# Altium project STM32F207.PrjPCB
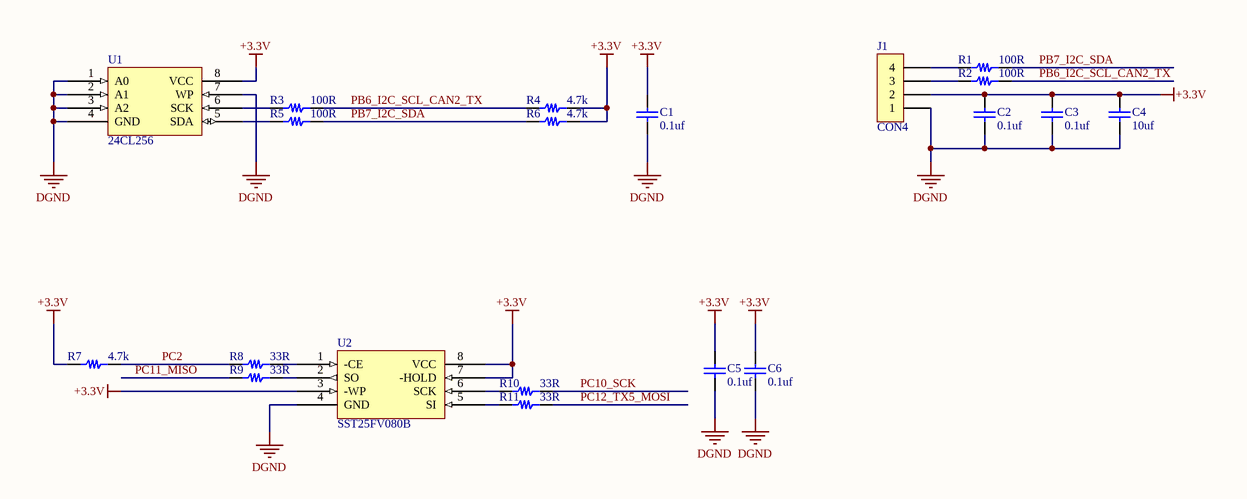
[diagram p0: at24c02_SST25FV080B_OLED.SchDoc]
11 sheets, 225 parts. Net scope: global (net labels, ports and power ports of the same name join across sheets).
Board file: STM32F207VE_Board.PcbDoc
Sheets:
  at24c02_SST25FV080B_OLED.SchDoc
  power.SchDoc
  STM32F107_207.SchDoc
  led.SchDoc
  Ethernet.SchDoc
  CAN.SchDoc
  RS232_485.SchDoc
  USB.SchDoc
  OV2640.SchDoc
  SD_NRF_RC522_W5500.SchDoc
  IO.SchDoc

## Sheet at24c02_SST25FV080B_OLED.SchDoc: STM32F208外部存储模块及OLED屏接口
size A4; Date: 2016-7-18; Author: Veiko; CompanyName: 艺嵌科技; DrawnBy: Veiko; DocumentNumber: 001; Revision: V1.0; CurrentTime: 14:27; DocumentName: STM32F208外部存储模块及OLED屏接口

### Parts
C1  0.1uf  [0805C]
C2  0.1uf  [0805C]
C3  0.1uf  [0805C]
C4  10uf  [0805C]
C5  0.1uf  [0805C]
C6  0.1uf  [0805C]
J1  CON4  [SIP4-2.54MM]
R1  100R  [0805_small]
R2  100R  [0805_small]
R3  100R  [0805_small]
R4  4.7k  [0805_small]
R5  100R  [0805_small]
R6  4.7k  [0805_small]
R7  4.7k  [0805_small]
R8  33R  [0805_small]
R9  33R  [0805_small]
R10  33R  [0805_small]
R11  33R  [0805_small]
U1  24CL256  [SO-8]
U2  SST25FV080B  [SO-8]

### Nets
+3.3V: C1.2 C2.2 C3.2 C4.2 C5.2 C6.2 J1.2 R4.1 R6.1 R7.2 U1.8(VCC) U2.3(-WP) U2.7(-HOLD) U2.8(VCC)
DGND: C1.1 C2.1 C3.1 C4.1 C5.1 C6.1 J1.1 U1.1(A0) U1.2(A1) U1.3(A2) U1.4(GND) U1.7(WP) U2.4(GND)
PB6_I2C_SCL_CAN2_TX: R2.1 R3.1 R4.2
PB7_I2C_SDA: R1.1 R5.1 R6.2
PC2: R7.1 R8.2
PC10_SCK: R10.1  [project net DATA2]
PC11_MISO: R9.2  [project net CD]
PC12_TX5_MOSI: R11.1  [project net CLK]
NetJ1_3: J1.3 R2.2
NetJ1_4: J1.4 R1.2
NetR3_2: R3.2 U1.6(SCK)
NetR5_2: R5.2 U1.5(SDA)
NetR8_1: R8.1 U2.1(-CE)
NetR9_1: R9.1 U2.2(SO)
NetR10_2: R10.2 U2.6(SCK)
NetR11_2: R11.2 U2.5(SI)

### Library data of the parts
C1-C6 = Cap: 贴片电容; Value: 100pF; Published: 8-Jun-2000; LatestRevisionDate: 17-Jul-2002; LatestRevisionNote: Re-released for DXP Platform.; PackageReference: RAD-0.3; Publisher: Altium Limited
J1 = CON4: Connector
R1-R11 = Res: 电阻; Value: 230k; Published: 24-Mar-1999; LatestRevisionDate: 29-May-2009; LatestRevisionNote: IPC-7351 Footprint Added.; PackageVersion: Mar-2003; PackageReference: 6-0805; Publisher: Altium Limited; PackageDescription: Chip Resistor 0805 Case Size; Code_IPC: RESC2012

## Sheet power.SchDoc
size A4
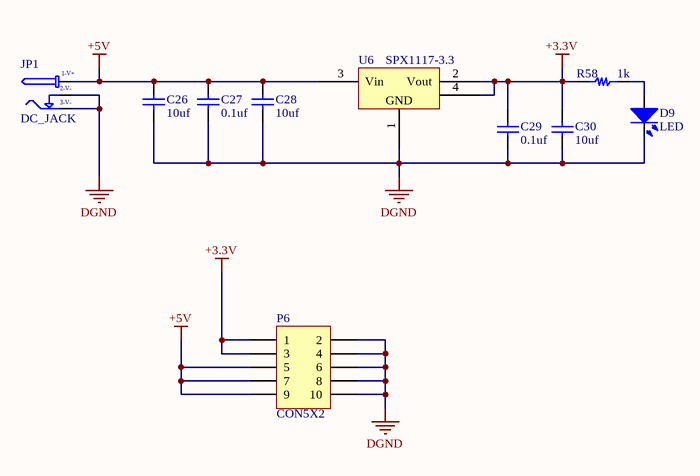
[diagram p1: power.SchDoc]

### Parts
C26  10uf  [0805C]
C27  0.1uf  [0805C]
C28  10uf  [0805C]
C29  0.1uf  [0805C]
C30  10uf  [0805C]
D9  LED  [0805-LED-RED]
JP1  DC_JACK  [DC3]
P6  CON5X2  [HDR2X5-2.54MM]
R58  1k  [0805_small]
U6  SPX1117-3.3  [SOT-223(DCY4)]

### Nets
+3.3V: C29.2 C30.2 P6.1 P6.3 R58.2 U6.2(Vout) U6.4
+5V: C26.2 C27.2 C28.2 JP1.1 P6.5 P6.7 P6.9 U6.3(Vin)
DGND: C26.1 C27.1 C28.1 C29.1 C30.1 D9.2(K) JP1.2 JP1.3 P6.2 P6.4 P6.6 P6.8 P6.10 U6.1
NetD9_1: D9.1(A) R58.1

### Notes on the sheet
- (in symbol DC_JACK) 1-V+; 2-V-; 3-V-
- (in symbol SPX1117) GND

### Library data of the parts
C26-C30 = Cap: 贴片电容; Value: 100pF; Published: 8-Jun-2000; LatestRevisionDate: 17-Jul-2002; LatestRevisionNote: Re-released for DXP Platform.; PackageReference: RAD-0.3; Publisher: Altium Limited
D9 = LED: Typical INFRARED GaAs LED; Published: 8-Jun-2000; LatestRevisionDate: 08-Jul-2005; LatestRevisionNote: Mech Layer 1 removed.; PackageReference: LED-0; Publisher: Altium Limited; PackageDescription: LED; 2 Leads
JP1 = DC_JACK: DC电源接口
P6 = CON5X2: Header, 5-Pin, Dual row; LatestRevisionDate: 17-Jul-2002; LatestRevisionNote: Re-released for DXP Platform.; Publisher: Altium Limited
R58 = Res: 电阻; Value: 230k; Published: 24-Mar-1999; LatestRevisionDate: 29-May-2009; LatestRevisionNote: IPC-7351 Footprint Added.; PackageVersion: Mar-2003; PackageReference: 6-0805; Publisher: Altium Limited; PackageDescription: Chip Resistor 0805 Case Size; Code_IPC: RESC2012
U6 = SPX1117

## Sheet STM32F107_207.SchDoc
size A4
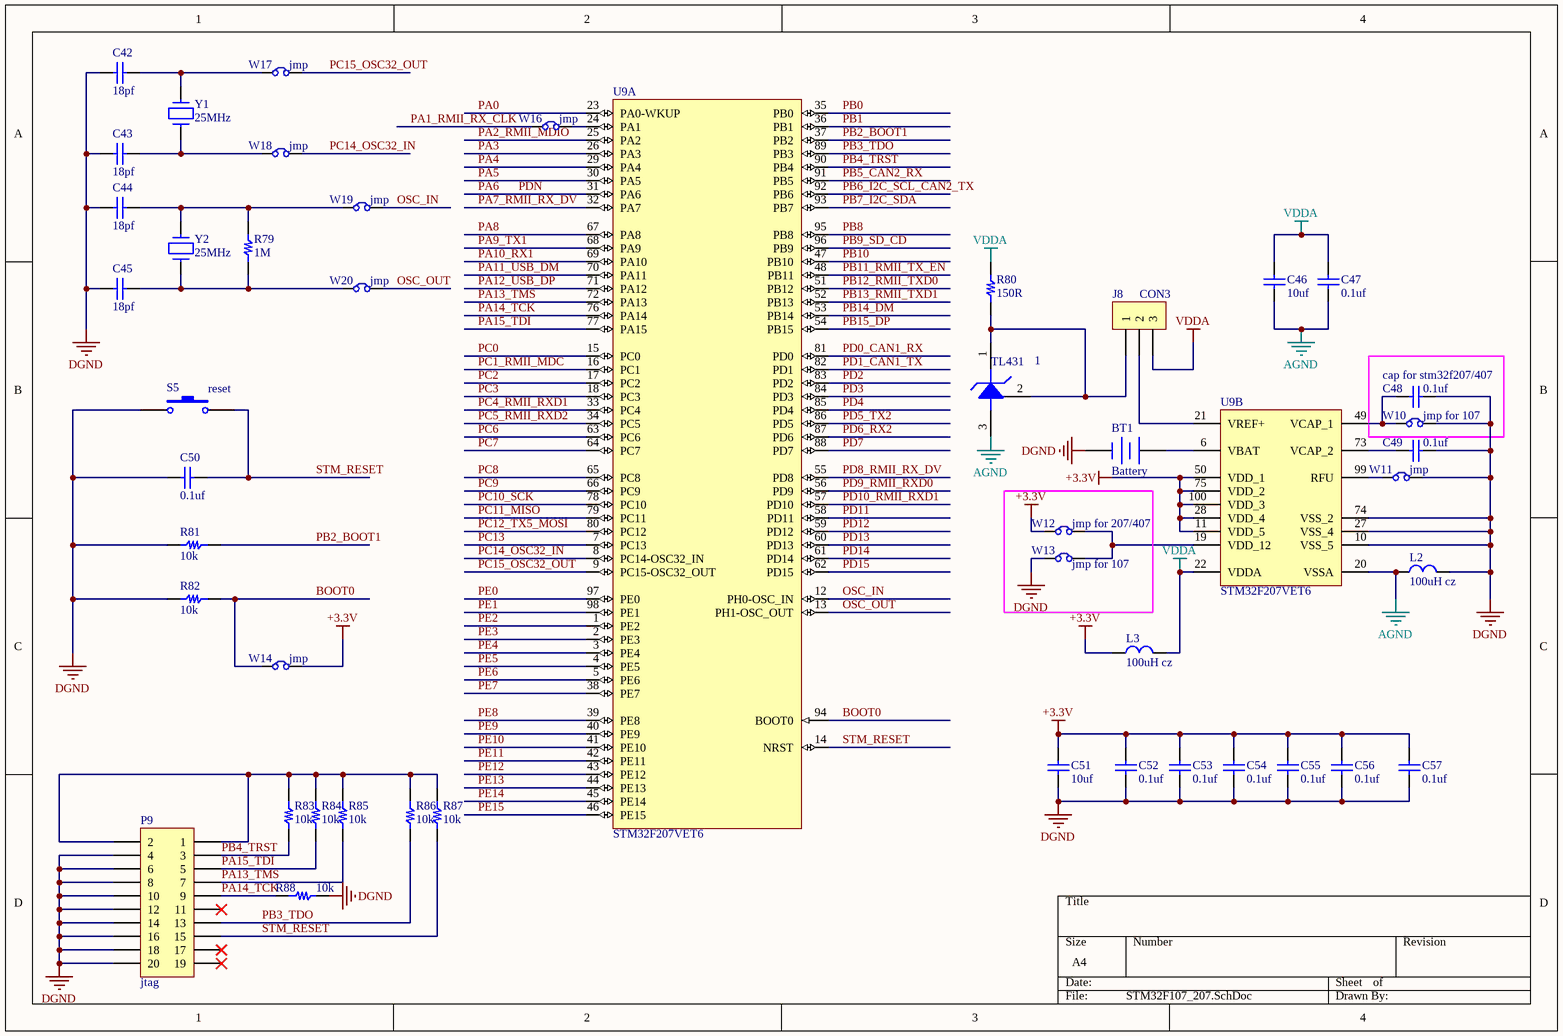
[diagram p2: STM32F107_207.SchDoc]

### Parts
1  TL431  [SOT23]
BT1  Battery  [CR1220]
C42  18pf  [0805C]
C43  18pf  [0805C]
C44  18pf  [0805C]
C45  18pf  [0805C]
C46  10uf  [0805C]
C47  0.1uf  [0805C]
C48  0.1uf  [0805C]
C49  0.1uf  [0805C]
C50  0.1uf  [0805C]
C51  10uf  [0805C]
C52  0.1uf  [0805C]
C53  0.1uf  [0805C]
C54  0.1uf  [0805C]
C55  0.1uf  [0805C]
C56  0.1uf  [0805C]
C57  0.1uf  [0805C]
J8  CON3  [sip3-2.54mm]
L2  100uH cz  [0805_SmallR]
L3  100uH cz  [0805_SmallR]
P9  jtag  [IDE20-2.54MM]
R79  1M  [0805_small]
R80  150R  [0805_small]
R81  10k  [0805_small]
R82  10k  [0805_small]
R83  10k  [0805_small]
R84  10k  [0805_small]
R85  10k  [0805_small]
R86  10k  [0805_small]
R87  10k  [0805_small]
R88  10k  [0805_small]
S5  reset  [k_TS_021]
U9  STM32F207VET6  [LQFP100_N]  (parts A,B of 2)
W10  jmp for 107  [0603_jump_Pad]
W11  jmp  [0603_jump_Pad]
W12  jmp for 207/407  [0603_jump_Pad]
W13  jmp for 107  [0603_jump_Pad]
W14  jmp  [0603_jump_Pad]
W16  jmp  [0603_jump_Pad]
W17  jmp  [0603_jump_Pad]
W18  jmp  [0603_jump_Pad]
W19  jmp  [0603_jump_Pad]
W20  jmp  [0603_jump_Pad]
Y1  25MHz  [CRY 32768-1]
Y2  25MHz  [CRYSTAL]

### Blocks framed on the sheet
cap for stm32f207/407: C48 W10

### Nets
+3.3V: C51.1 C52.1 C53.1 C54.1 C55.1 C56.1 C57.1 L3.1 U9.11(VDD_5) U9.28(VDD_4) U9.50(VDD_1) U9.75(VDD_2) U9.100(VDD_3) W12.1(C1) W14.2(C2)
AGND: 1.3(ANODE) C46.1 C47.1 L2.1 U9.20(VSSA)
DGND: BT1.2(-) C42.2 C43.2 C44.2 C45.2 C48.1 C49.1 C50.2 C51.2 C52.2 C53.2 C54.2 C55.2 C56.2 C57.2 L2.2 P9.4 P9.6 P9.8 P9.10 P9.12 P9.14 P9.16 P9.18 P9.20 R81.2 R82.2 R88.2 S5.1 U9.10(VSS_5) U9.27(VSS_4) U9.74(VSS_2) W10.2(C2) W11.2(C2) W13.1(C1)
VDDA: C46.2 C47.2 J8.3 L3.2 R80.2 U9.22(VDDA)
BOOT0: R82.1 U9.94(BOOT0) W14.1(C1)
OSC_IN: U9.12(PH0-OSC_IN) W19.2(C2)
OSC_OUT: U9.13(PH1-OSC_OUT) W20.2(C2)
PA0: U9.23(PA0-WKUP)
PA1_RMII_RX_CLK: W16.1(C1)
PA2_RMII_MDIO: U9.25(PA2)
PA3: U9.26(PA3)
PA4: U9.29(PA4)
PA5: U9.30(PA5)
PA6: U9.31(PA6)  [also labelled PDN]
PA7_RMII_RX_DV: U9.32(PA7)
PA8: U9.67(PA8)
PA9_TX1: U9.68(PA9)
PA10_RX1: U9.69(PA10)
PA11_USB_DM: U9.70(PA11)
PA12_USB_DP: U9.71(PA12)
PA13_TMS: P9.7 R85.2 U9.72(PA13)
PA14_TCK: P9.9 R88.1 U9.76(PA14)
PA15_TDI: P9.5 R84.2 U9.77(PA15)
PB0: U9.35(PB0)
PB1: U9.36(PB1)
PB2_BOOT1: R81.1 U9.37(PB2)
PB3_TDO: P9.13 R86.2 U9.89(PB3)
PB4_TRST: P9.3 R83.2 U9.90(PB4)
PB5_CAN2_RX: U9.91(PB5)
PB6_I2C_SCL_CAN2_TX: U9.92(PB6)
PB7_I2C_SDA: U9.93(PB7)
PB8: U9.95(PB8)
PB9_SD_CD: U9.96(PB9)
PB10: U9.47(PB10)
PB11_RMII_TX_EN: U9.48(PB11)
PB12_RMII_TXD0: U9.51(PB12)
PB13_RMII_TXD1: U9.52(PB13)
PB14_DM: U9.53(PB14)
PB15_DP: U9.54(PB15)
PC0: U9.15(PC0)
PC1_RMII_MDC: U9.16(PC1)
PC2: U9.17(PC2)
PC3: U9.18(PC3)
PC4_RMII_RXD1: U9.33(PC4)
PC5_RMII_RXD2: U9.34(PC5)
PC6: U9.63(PC6)
PC7: U9.64(PC7)
PC8: U9.65(PC8)  [project net DTAT0]
PC9: U9.66(PC9)  [project net DTAT1]
PC10_SCK: U9.78(PC10)  [project net DATA2]
PC11_MISO: U9.79(PC11)  [project net CD]
PC12_TX5_MOSI: U9.80(PC12)  [project net CLK]
PC13: U9.7(PC13)
PC14_OSC32_IN: U9.8(PC14-OSC32_IN) W18.2(C2)
PC15_OSC32_OUT: U9.9(PC15-OSC32_OUT) W17.2(C2)
PD0_CAN1_RX: U9.81(PD0)
PD1_CAN1_TX: U9.82(PD1)
PD2: U9.83(PD2)  [project net CMD]
PD3: U9.84(PD3)
PD4: U9.85(PD4)
PD5_TX2: U9.86(PD5)
PD6_RX2: U9.87(PD6)
PD7: U9.88(PD7)
PD8_RMII_RX_DV: U9.55(PD8)
PD9_RMII_RXD0: U9.56(PD9)
PD10_RMII_RXD1: U9.57(PD10)
PD11: U9.58(PD11)
PD12: U9.59(PD12)
PD13: U9.60(PD13)
PD14: U9.61(PD14)
PD15: U9.62(PD15)
PE0: U9.97(PE0)
PE1: U9.98(PE1)
PE2: U9.1(PE2)
PE3: U9.2(PE3)
PE4: U9.3(PE4)
PE5: U9.4(PE5)
PE6: U9.5(PE6)
PE7: U9.38(PE7)
PE8: U9.39(PE8)
PE9: U9.40(PE9)
PE10: U9.41(PE10)
PE11: U9.42(PE11)
PE12: U9.43(PE12)
PE13: U9.44(PE13)
PE14: U9.45(PE14)
PE15: U9.46(PE15)
STM_RESET: C50.1 P9.15 R87.2 S5.2 U9.14(NRST)
Net1_1: 1.1(CATHODE) 1.2(REF) J8.1 R80.1
NetBT1_1: BT1.1(+) U9.6(VBAT)
NetC42_1: C42.1 W17.1(C1) Y1.2
NetC43_1: C43.1 W18.1(C1) Y1.1
NetC44_1: C44.1 R79.2 W19.1(C1) Y2.2
NetC45_1: C45.1 R79.1 W20.1(C1) Y2.1
NetC48_2: C48.2 U9.49(VCAP_1) W10.1(C1)
NetC49_2: C49.2 U9.73(VCAP_2)
NetJ8_2: J8.2 U9.21(VREF+)
NetP9_1: P9.1 P9.2 R83.1 R84.1 R85.1 R86.1 R87.1
NetU9_19: U9.19(VDD_12) W12.2(C2) W13.2(C2)
NetU9_24: U9.24(PA1) W16.2(C2)
NetU9_99: U9.99(RFU) W11.1(C1)

Not connected (* = marked no-connect by the designer): P9 11* 17* 19*

### Library data of the parts
BT1 = Battery: Multicell Battery; Published: 24-Mar-1999; LatestRevisionDate: 17-Jul-2002; LatestRevisionNote: Re-released for DXP Platform.; PackageReference: BAT-2; Publisher: Altium Limited; PackageDescription: Battery; 2 Leads
C42-C57 = Cap: 贴片电容; Value: 100pF; Published: 8-Jun-2000; LatestRevisionDate: 17-Jul-2002; LatestRevisionNote: Re-released for DXP Platform.; PackageReference: RAD-0.3; Publisher: Altium Limited
J8 = CON3: Connector
L2 L3 = Inductor: 电感; Code_IEC: 1005; Value: 4.7uH; Published: 8-Jun-2000; LatestRevisionDate: 29-May-2009; LatestRevisionNote: IPC-7351 Footprint Added.; PackageReference: 0402-A; Publisher: Altium Limited; PackageDescription: Chip Inductor; Code_JEITA: 0402
P9 = CON10X2: Header, 10-Pin, Dual row; LatestRevisionDate: 17-Jul-2002; LatestRevisionNote: Re-released for DXP Platform.; Publisher: Altium Limited
R79-R88 = Res: 电阻; Value: 230k; Published: 24-Mar-1999; LatestRevisionDate: 29-May-2009; LatestRevisionNote: IPC-7351 Footprint Added.; PackageVersion: Mar-2003; PackageReference: 6-0805; Publisher: Altium Limited; PackageDescription: Chip Resistor 0805 Case Size; Code_IPC: RESC2012
S5 = SW-PB-2: Switch; Published: 24-Mar-1999; LatestRevisionDate: 17-Jul-2002; LatestRevisionNote: Re-released for DXP Platform.; PackageReference: SPST-2; Publisher: Altium Limited; PackageDescription: Switch; 2 Leads
U9 = STM32F207VET6: STM32 ARM-based 32-bit MCU Connectivity Line & Ethernet with 512 kB Flash, 128 kB Internal RAM, -40 to +85°C Temperature, 100-Pin LQFP, Tray; DatasheetVersion: rev6.0, Apr-2011; PackageVersion: rev13, Apr-2011; PackageReference: LQFP100; PackageDescription: 100-Pin Low-Profile Quad Flat Pack, 14 x 14 mm Body, 0.5 mm Pitch (LQFP100); ComponentLink1Description: Manufacturer URL; ComponentLink1URL: http://www.st.com/; ComponentLink2Description: STM32F205/207 Datasheet; ComponentLink2URL: http://www.st.com/internet/com/TECHNICAL_RESOURCES/TECHNICAL_LITERATURE/DATASHEET/CD00237391.pdf; ComponentLink3Description: STM32 Family Web Page; ComponentLink3URL: www.st.com/stm32
W10-W14 W16-W20 = Jumper: Jumper Wire; Published: 24-Mar-1999; LatestRevisionDate: 17-Jul-2002; LatestRevisionNote: Re-released for DXP Platform.; PackageReference: RAD-0.2; Publisher: Altium Limited; PackageDescription: Radial Cap, Thru-Hole; 2 Leads; 0.2 in Pin Spacing
Y1 Y2 = CRYSTAL: JZ; Value: 4MHz

## Sheet led.SchDoc
size A4
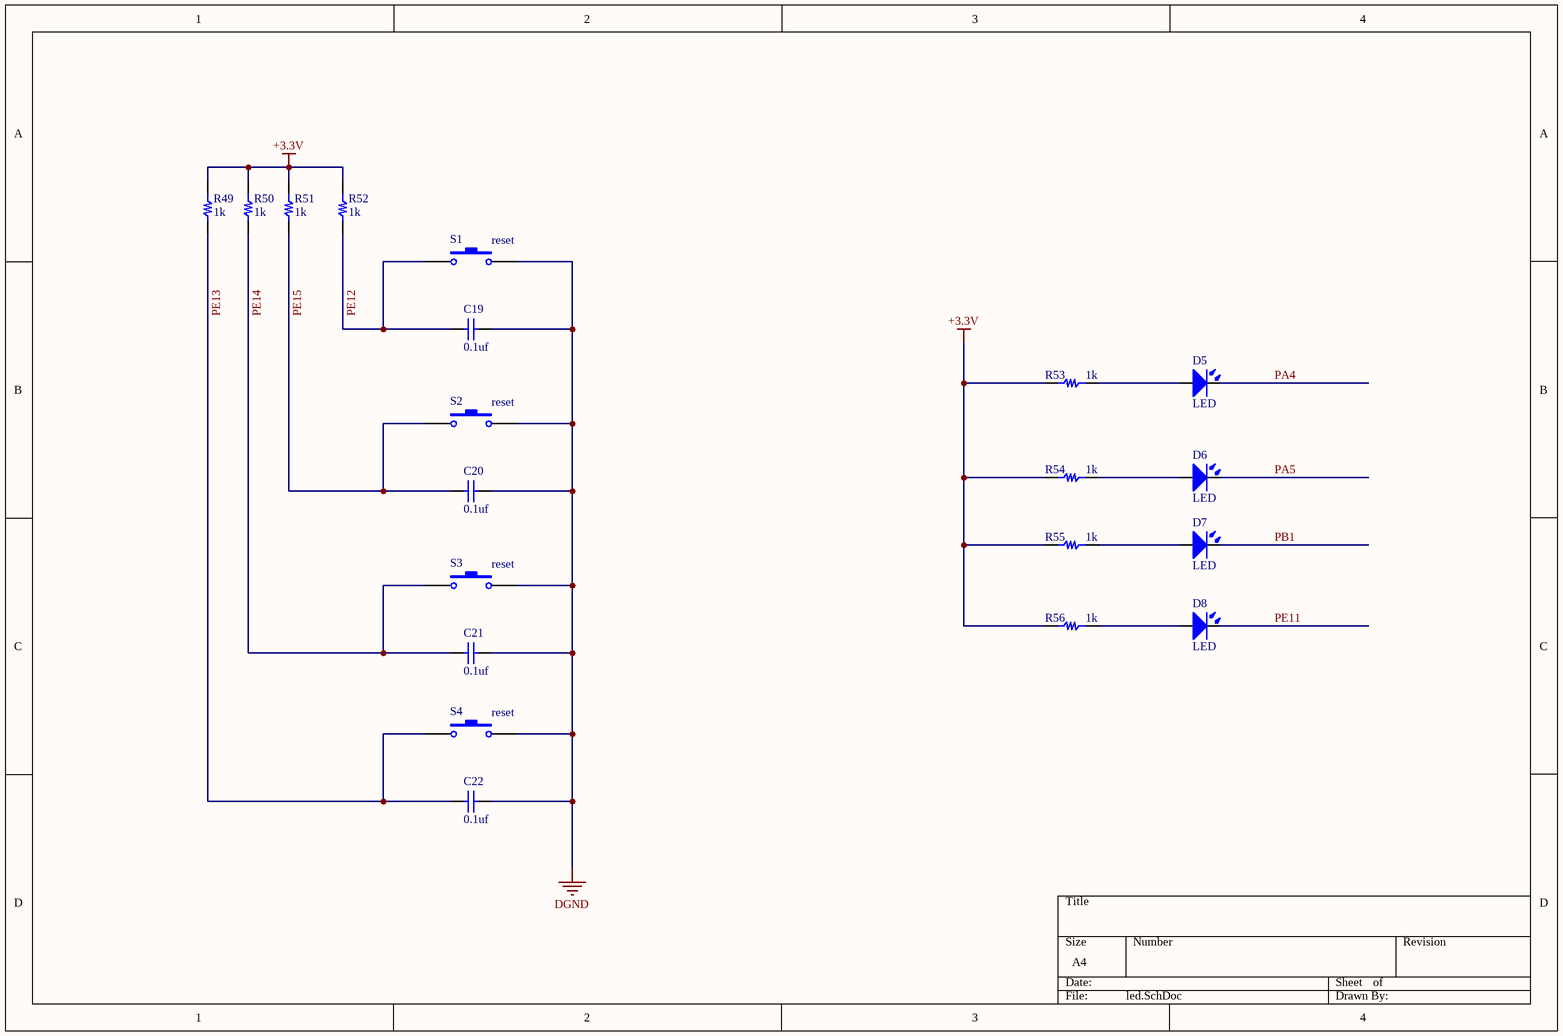
[diagram p3: led.SchDoc]

### Parts
C19  0.1uf  [0805C]
C20  0.1uf  [0805C]
C21  0.1uf  [0805C]
C22  0.1uf  [0805C]
D5  LED  [0805-LED-RED]
D6  LED  [0805-LED-RED]
D7  LED  [0805-LED-RED]
D8  LED  [0805-LED-RED]
R49  1k  [0805_small]
R50  1k  [0805_small]
R51  1k  [0805_small]
R52  1k  [0805_small]
R53  1k  [0805_small]
R54  1k  [0805_small]
R55  1k  [0805_small]
R56  1k  [0805_small]
S1  reset  [k_TS_021]
S2  reset  [k_TS_021]
S3  reset  [k_TS_021]
S4  reset  [k_TS_021]

### Nets
+3.3V: R49.1 R50.1 R51.1 R52.1 R53.2 R54.2 R55.2 R56.2
DGND: C19.1 C20.1 C21.1 C22.1 S1.2 S2.2 S3.2 S4.2
PA4: D5.2(K)
PA5: D6.2(K)
PB1: D7.2(K)
PE11: D8.2(K)
PE12: C19.2 R52.2 S1.1
PE13: C22.2 R49.2 S4.1
PE14: C21.2 R50.2 S3.1
PE15: C20.2 R51.2 S2.1
NetD5_1: D5.1(A) R53.1
NetD6_1: D6.1(A) R54.1
NetD7_1: D7.1(A) R55.1
NetD8_1: D8.1(A) R56.1

### Library data of the parts
C19-C22 = Cap: 贴片电容; Value: 100pF; Published: 8-Jun-2000; LatestRevisionDate: 17-Jul-2002; LatestRevisionNote: Re-released for DXP Platform.; PackageReference: RAD-0.3; Publisher: Altium Limited
D5-D8 = LED: Typical INFRARED GaAs LED; Published: 8-Jun-2000; LatestRevisionDate: 08-Jul-2005; LatestRevisionNote: Mech Layer 1 removed.; PackageReference: LED-0; Publisher: Altium Limited; PackageDescription: LED; 2 Leads
R49-R56 = Res: 电阻; Value: 230k; Published: 24-Mar-1999; LatestRevisionDate: 29-May-2009; LatestRevisionNote: IPC-7351 Footprint Added.; PackageVersion: Mar-2003; PackageReference: 6-0805; Publisher: Altium Limited; PackageDescription: Chip Resistor 0805 Case Size; Code_IPC: RESC2012
S1-S4 = SW-PB-2: Switch; Published: 24-Mar-1999; LatestRevisionDate: 17-Jul-2002; LatestRevisionNote: Re-released for DXP Platform.; PackageReference: SPST-2; Publisher: Altium Limited; PackageDescription: Switch; 2 Leads

## Sheet Ethernet.SchDoc
size A4
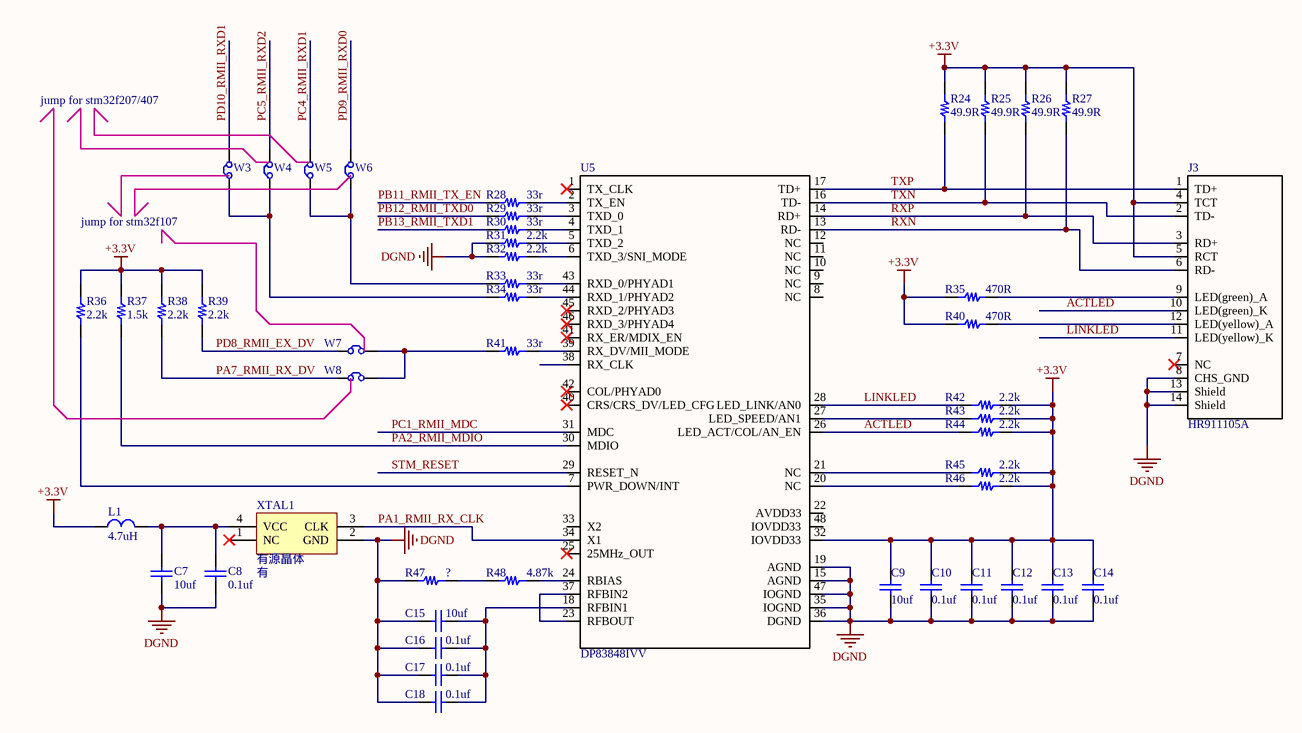
[diagram p4: Ethernet.SchDoc]

### Parts
C7  10uf  [0805C]
C8  0.1uf  [0805C]
C9  10uf  [0805C]
C10  0.1uf  [0805C]
C11  0.1uf  [0805C]
C12  0.1uf  [0805C]
C13  0.1uf  [0805C]
C14  0.1uf  [0805C]
C15  10uf  [0805C]
C16  0.1uf  [0805C]
C17  0.1uf  [0805C]
C18  0.1uf  [0805C]
J3  HR911105A  [RJ45-HR911105A]
L1  4.7uH  [0805_SmallR]
R24  49.9R  [0805_small]
R25  49.9R  [0805_small]
R26  49.9R  [0805_small]
R27  49.9R  [0805_small]
R28  33r  [0805_small]
R29  33r  [0805_small]
R30  33r  [0805_small]
R31  2.2k  [0805_small]
R32  2.2k  [0805_small]
R33  33r  [0805_small]
R34  33r  [0805_small]
R35  470R  [0805_small]
R36  2.2k  [0805_small]
R37  1.5k  [0805_small]
R38  2.2k  [0805_small]
R39  2.2k  [0805_small]
R40  470R  [0805_small]
R41  33r  [0805_small]
R42  2.2k  [0805_small]
R43  2.2k  [0805_small]
R44  2.2k  [0805_small]
R45  2.2k  [0805_small]
R46  2.2k  [0805_small]
R47  ?  [0805_small]
R48  4.87k  [0805_small]
U5  DP83848IVV  [LQFP-48]
W3  (no value)  [0603_jump_Pad]
W4  (no value)  [0603_jump_Pad]
W5  (no value)  [0603_jump_Pad]
W6  (no value)  [0603_jump_Pad]
W7  (no value)  [0603_jump_Pad]
W8  (no value)  [0603_jump_Pad]
XTAL1  有源晶体  [贴片有源晶体]

### Nets
+3.3V: C9.1 C10.1 C11.1 C12.1 C13.1 C14.1 J3.4(TCT) J3.5(RCT) L1.1 R24.1 R25.1 R26.1 R27.1 R35.1 R36.1 R37.1 R38.1 R39.1 R40.1 R42.2 R43.2 R44.2 R45.2 R46.2 U5.32(IOVDD33)
DGND: C7.2 C8.2 C9.2 C10.2 C11.2 C12.2 C13.2 C14.2 C15.2 C16.2 C17.2 C18.2 J3.8(CHS_GND) J3.13(Shield) J3.14(Shield) R31.2 R32.2 R47.2 U5.15(AGND) U5.19(AGND) U5.35(IOGND) U5.36(DGND) U5.47(IOGND) XTAL1.2(GND)
ACTLED: J3.10(LED(green)_K) R44.1 U5.26(LED_ACT/COL/AN_EN)
LINKLED: J3.11(LED(yellow)_K) R42.1 U5.28(LED_LINK/AN0)
PA1_RMII_RX_CLK: U5.34(X1) XTAL1.3(CLK)
PA2_RMII_MDIO: R37.2 U5.30(MDIO)
PA7_RMII_RX_DV: R38.2 W8.1(C1)
PB11_RMII_TX_EN: R28.2
PB12_RMII_TXD0: R29.2
PB13_RMII_TXD1: R30.2
PC1_RMII_MDC: U5.31(MDC)
PC4_RMII_RXD1: W5.2(C2)
PC5_RMII_RXD2: W4.2(C2)
PD8_RMII_EX_DV: R39.2 W7.1(C1)
PD9_RMII_RXD0: W6.2(C2)
PD10_RMII_RXD1: W3.2(C2)
RXN: J3.6(RD-) R27.2 U5.13(RD-)
RXP: J3.3(RD+) R26.2 U5.14(RD+)
STM_RESET: U5.29(RESET_N)
TXN: J3.2(TD-) R25.2 U5.16(TD-)
TXP: J3.1(TD+) R24.2 U5.17(TD+)
NetC7_1: C7.1 C8.1 L1.2 XTAL1.4(VCC)
NetC15_1: C15.1 C16.1 C17.1 C18.1 U5.18(RFBIN1)
NetJ3_9: J3.9(LED(green)_A) R35.2
NetJ3_12: J3.12(LED(yellow)_A) R40.2
NetR28_1: R28.1 U5.2(TX_EN)
NetR29_1: R29.1 U5.3(TXD_0)
NetR30_1: R30.1 U5.4(TXD_1)
NetR31_1: R31.1 U5.5(TXD_2)
NetR32_1: R32.1 U5.6(TXD_3/SNI_MODE)
NetR33_1: R33.1 U5.43(RXD_0/PHYAD1)
NetR33_2: R33.2 W5.1(C1) W6.1(C1)
NetR34_1: R34.1 U5.44(RXD_1/PHYAD2)
NetR34_2: R34.2 W3.1(C1) W4.1(C1)
NetR36_2: R36.2 U5.7(PWR_DOWN/INT)
NetR41_1: R41.1 U5.39(RX_DV/MII_MODE)
NetR41_2: R41.2 W7.2(C2) W8.2(C2)
NetR43_1: R43.1 U5.27(LED_SPEED/AN1)
NetR45_1: R45.1 U5.21(NC)
NetR46_1: R46.1 U5.20(NC)
NetR47_1: R47.1 R48.2
NetR48_1: R48.1 U5.24(RBIAS)
NetU5_23: U5.23(RFBOUT) U5.37(RFBIN2)

Not connected (* = marked no-connect by the designer): J3 7(NC)*; U5 1(TX_CLK)* 8(NC) 9(NC) 10(NC) 11(NC) 12(NC) 22(AVDD33) 25(25MHz_OUT)* 33(X2) 38(RX_CLK) 40(CRS/CRS_DV/LED_CFG)* 41(RX_ER/MDIX_EN)* 42(COL/PHYAD0)* 45(RXD_2/PHYAD3)* 46(RXD_3/PHYAD4)* 48(IOVDD33); XTAL1 1(NC)*

### Notes on the sheet
- jump for stm32f207/407
- jump for stm32f107
- (in symbol 有源晶体) 有

### Library data of the parts
C7-C18 = Cap: 贴片电容; Value: 100pF; Published: 8-Jun-2000; LatestRevisionDate: 17-Jul-2002; LatestRevisionNote: Re-released for DXP Platform.; PackageReference: RAD-0.3; Publisher: Altium Limited
J3 = HR911105A: 带网络变压器的网络接口
L1 = Inductor: 电感; Code_IEC: 1005; Published: 8-Jun-2000; LatestRevisionDate: 29-May-2009; LatestRevisionNote: IPC-7351 Footprint Added.; PackageReference: 0402-A; Publisher: Altium Limited; PackageDescription: Chip Inductor; Code_JEITA: 0402; Value: 4.7uH
R24-R48 = Res: 电阻; Value: 230k; Published: 24-Mar-1999; LatestRevisionDate: 29-May-2009; LatestRevisionNote: IPC-7351 Footprint Added.; PackageVersion: Mar-2003; PackageReference: 6-0805; Publisher: Altium Limited; PackageDescription: Chip Resistor 0805 Case Size; Code_IPC: RESC2012
U5 = DP83848IVV: DP83848 PHY
W3-W8 = Jumper: Jumper Wire; Published: 24-Mar-1999; LatestRevisionDate: 17-Jul-2002; LatestRevisionNote: Re-released for DXP Platform.; PackageReference: RAD-0.2; Publisher: Altium Limited; PackageDescription: Radial Cap, Thru-Hole; 2 Leads; 0.2 in Pin Spacing

## Sheet CAN.SchDoc
size A4
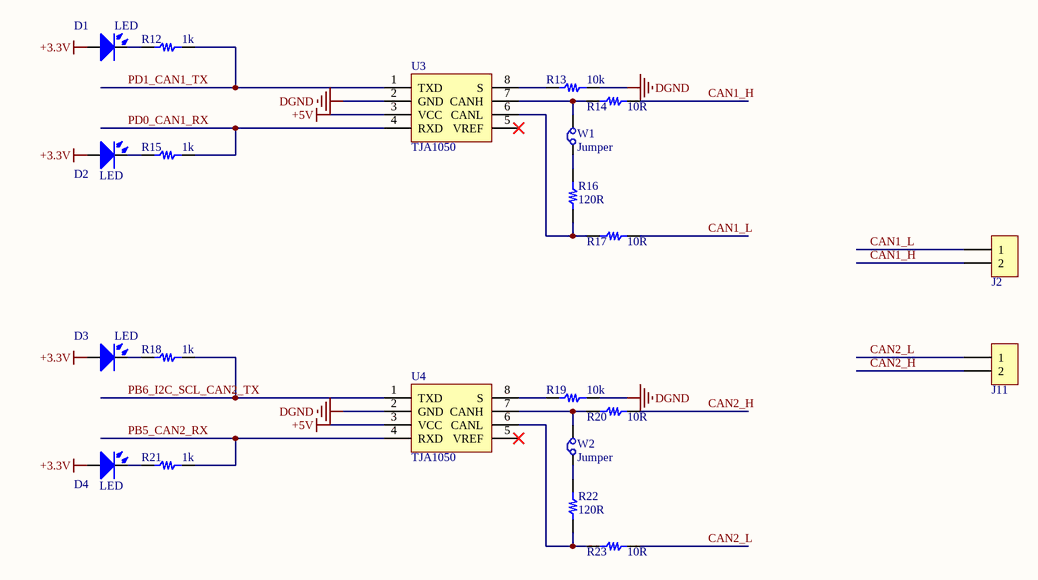
[diagram p5: CAN.SchDoc]

### Parts
D1  LED  [0805-LED-RED]
D2  LED  [0805-LED-RED]
D3  LED  [0805-LED-RED]
D4  LED  [0805-LED-RED]
J2  CON2  [XH2.54-2P]  (value not drawn)
J11  CON2  [XH2.54-2P]  (value not drawn)
R12  1k  [0805_small]
R13  10k  [0805_small]
R14  10R  [0805_small]
R15  1k  [0805_small]
R16  120R  [0805_small]
R17  10R  [0805_small]
R18  1k  [0805_small]
R19  10k  [0805_small]
R20  10R  [0805_small]
R21  1k  [0805_small]
R22  120R  [0805_small]
R23  10R  [0805_small]
U3  TJA1050  [SO-8]
U4  TJA1050  [SO-8]
W1  Jumper  [0603_jump_Pad]
W2  Jumper  [0603_jump_Pad]

### Nets
+3.3V: D1.1(A) D2.1(A) D3.1(A) D4.1(A)
+5V: U3.3(VCC) U4.3(VCC)
DGND: R13.1 R19.1 U3.2(GND) U4.2(GND)
CAN1_H: J2.2 R14.2
CAN1_L: J2.1 R17.2
CAN2_H: J11.2 R20.2
CAN2_L: J11.1 R23.2
PB5_CAN2_RX: R21.1 U4.4(RXD)
PB6_I2C_SCL_CAN2_TX: R18.1 U4.1(TXD)
PD0_CAN1_RX: R15.1 U3.4(RXD)
PD1_CAN1_TX: R12.1 U3.1(TXD)
NetD1_2: D1.2(K) R12.2
NetD2_2: D2.2(K) R15.2
NetD3_2: D3.2(K) R18.2
NetD4_2: D4.2(K) R21.2
NetR13_2: R13.2 U3.8(S)
NetR14_1: R14.1 U3.7(CANH) W1.2(C2)
NetR16_1: R16.1 W1.1(C1)
NetR16_2: R16.2 R17.1 U3.6(CANL)
NetR19_2: R19.2 U4.8(S)
NetR20_1: R20.1 U4.7(CANH) W2.2(C2)
NetR22_1: R22.1 W2.1(C1)
NetR22_2: R22.2 R23.1 U4.6(CANL)

Not connected (* = marked no-connect by the designer): U3 5(VREF)*; U4 5(VREF)*

### Library data of the parts
D1-D4 = LED: Typical INFRARED GaAs LED; Published: 8-Jun-2000; LatestRevisionDate: 08-Jul-2005; LatestRevisionNote: Mech Layer 1 removed.; PackageReference: LED-0; Publisher: Altium Limited; PackageDescription: LED; 2 Leads
J2 J11 = CON2: Connector
R12-R23 = Res: 电阻; Value: 230k; Published: 24-Mar-1999; LatestRevisionDate: 29-May-2009; LatestRevisionNote: IPC-7351 Footprint Added.; PackageVersion: Mar-2003; PackageReference: 6-0805; Publisher: Altium Limited; PackageDescription: Chip Resistor 0805 Case Size; Code_IPC: RESC2012
W1 W2 = Jumper: Jumper Wire; Published: 24-Mar-1999; LatestRevisionDate: 17-Jul-2002; LatestRevisionNote: Re-released for DXP Platform.; PackageReference: RAD-0.2; Publisher: Altium Limited; PackageDescription: Radial Cap, Thru-Hole; 2 Leads; 0.2 in Pin Spacing

## Sheet RS232_485.SchDoc
size A4
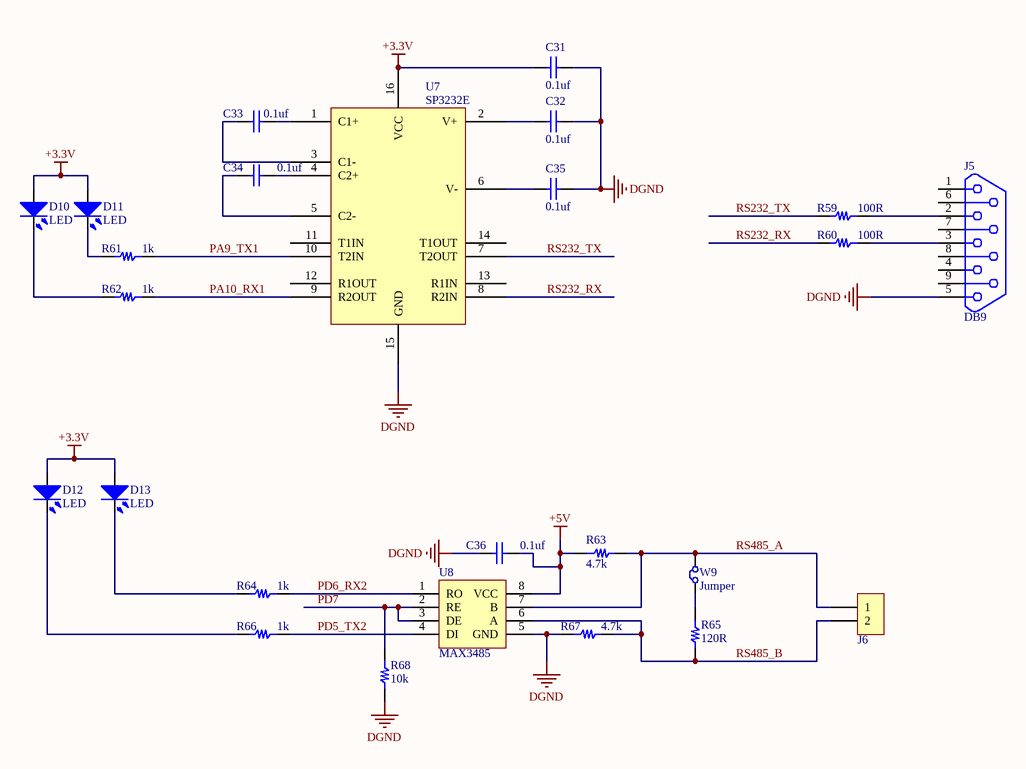
[diagram p6: RS232_485.SchDoc]

### Parts
C31  0.1uf  [0805C]
C32  0.1uf  [0805C]
C33  0.1uf  [0805C]
C34  0.1uf  [0805C]
C35  0.1uf  [0805C]
C36  0.1uf  [0805C]
D10  LED  [0805-LED-RED]
D11  LED  [0805-LED-RED]
D12  LED  [0805-LED-RED]
D13  LED  [0805-LED-RED]
J5  DB9  [DB9RA/M]
J6  CON2  [XH2.54-2P]  (value not drawn)
R59  100R  [0805_small]
R60  100R  [0805_small]
R61  1k  [0805_small]
R62  1k  [0805_small]
R63  4.7k  [0805_small]
R64  1k  [0805_small]
R65  120R  [0805_small]
R66  1k  [0805_small]
R67  4.7k  [0805_small]
R68  10k  [0805_small]
U7  SP3232E  [SO-16]
U8  MAX3485  [SO-8]
W9  Jumper  [0603_jump_Pad]

### Nets
+3.3V: C31.2 D10.1(A) D11.1(A) D12.1(A) D13.1(A) U7.16(VCC)
+5V: C36.1 R63.1 U8.8(VCC)
DGND: C31.1 C32.1 C35.1 C36.2 J5.5 R67.1 R68.2 U7.15(GND) U8.5(GND)
PA9_TX1: R61.1 U7.10(T2IN)
PA10_RX1: R62.1 U7.9(R2OUT)
PD5_TX2: R66.1 U8.4(DI)
PD6_RX2: R64.1 U8.1(RO)
PD7: R68.1 U8.2(RE) U8.3(DE)
RS232_RX: R60.2 U7.8(R2IN)
RS232_TX: R59.2 U7.7(T2OUT)
RS485_A: J6.1 R63.2 U8.7(B) W9.2(C2)
RS485_B: J6.2 R65.2 R67.2 U8.6(A)
NetC32_2: C32.2 U7.2(V+)
NetC33_1: C33.1 U7.1(C1+)
NetC33_2: C33.2 U7.3(C1-)
NetC34_1: C34.1 U7.4(C2+)
NetC34_2: C34.2 U7.5(C2-)
NetC35_2: C35.2 U7.6(V-)
NetD10_2: D10.2(K) R62.2
NetD11_2: D11.2(K) R61.2
NetD12_2: D12.2(K) R66.2
NetD13_2: D13.2(K) R64.2
NetJ5_2: J5.2 R59.1
NetJ5_3: J5.3 R60.1
NetR65_1: R65.1 W9.1(C1)

Not connected (* = marked no-connect by the designer): J5 1 4 6 7 8 9; U7 11(T1IN) 12(R1OUT) 13(R1IN) 14(T1OUT)

### Library data of the parts
C31-C36 = Cap: 贴片电容; Value: 100pF; Published: 8-Jun-2000; LatestRevisionDate: 17-Jul-2002; LatestRevisionNote: Re-released for DXP Platform.; PackageReference: RAD-0.3; Publisher: Altium Limited
D10-D13 = LED: Typical INFRARED GaAs LED; Published: 8-Jun-2000; LatestRevisionDate: 08-Jul-2005; LatestRevisionNote: Mech Layer 1 removed.; PackageReference: LED-0; Publisher: Altium Limited; PackageDescription: LED; 2 Leads
J6 = CON2: Connector
R59-R68 = Res: 电阻; Value: 230k; Published: 24-Mar-1999; LatestRevisionDate: 29-May-2009; LatestRevisionNote: IPC-7351 Footprint Added.; PackageVersion: Mar-2003; PackageReference: 6-0805; Publisher: Altium Limited; PackageDescription: Chip Resistor 0805 Case Size; Code_IPC: RESC2012
W9 = Jumper: Jumper Wire; Published: 24-Mar-1999; LatestRevisionDate: 17-Jul-2002; LatestRevisionNote: Re-released for DXP Platform.; PackageReference: RAD-0.2; Publisher: Altium Limited; PackageDescription: Radial Cap, Thru-Hole; 2 Leads; 0.2 in Pin Spacing

## Sheet USB.SchDoc
size A4
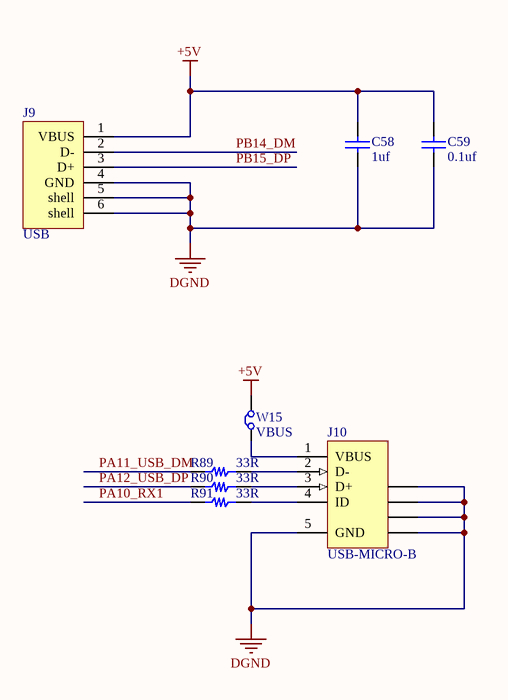
[diagram p7: USB.SchDoc]

### Parts
C58  1uf  [0805C]
C59  0.1uf  [0805C]
J9  USB  [USB-A]
J10  USB-MICRO-B  [USB-MINI-B]
R89  33R  [0805_small]
R90  33R  [0805_small]
R91  33R  [0805_small]
W15  VBUS  [sip2-2.54mm]

### Nets
+5V: C58.1 C59.1 J9.1(VBUS) W15.2(C2)
DGND: C58.2 C59.2 J9.4(GND) J9.5(shell) J9.6(shell) J10.5(GND) J10.6(SHLD) J10.7(SHLD) J10.8(SHLD) J10.9(SHLD)
PA10_RX1: R91.2
PA11_USB_DM: R89.2
PA12_USB_DP: R90.2
PB14_DM: J9.2(D-)
PB15_DP: J9.3(D+)
NetJ10_1: J10.1(VBUS) W15.1(C1)
NetJ10_2: J10.2(D-) R89.1
NetJ10_3: J10.3(D+) R90.1
NetJ10_4: J10.4(ID) R91.1

### Library data of the parts
C58 C59 = Cap: 贴片电容; Value: 100pF; Published: 8-Jun-2000; LatestRevisionDate: 17-Jul-2002; LatestRevisionNote: Re-released for DXP Platform.; PackageReference: RAD-0.3; Publisher: Altium Limited
R89-R91 = Res: 电阻; Value: 230k; Published: 24-Mar-1999; LatestRevisionDate: 29-May-2009; LatestRevisionNote: IPC-7351 Footprint Added.; PackageVersion: Mar-2003; PackageReference: 6-0805; Publisher: Altium Limited; PackageDescription: Chip Resistor 0805 Case Size; Code_IPC: RESC2012
W15 = Jumper: Jumper Wire; Published: 24-Mar-1999; LatestRevisionDate: 17-Jul-2002; LatestRevisionNote: Re-released for DXP Platform.; PackageReference: RAD-0.2; Publisher: Altium Limited; PackageDescription: Radial Cap, Thru-Hole; 2 Leads; 0.2 in Pin Spacing

## Sheet OV2640.SchDoc
size A4
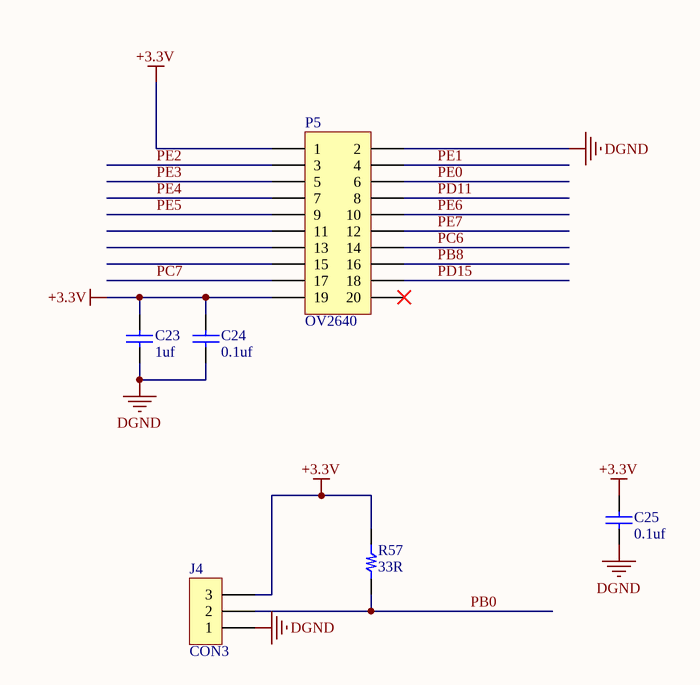
[diagram p8: OV2640.SchDoc]

### Parts
C23  1uf  [0805C]
C24  0.1uf  [0805C]
C25  0.1uf  [0805C]
J4  CON3  [HDR1X3-2.54MM]
P5  OV2640  [HDR2X10-2.54MM]
R57  33R  [0805_small]

### Nets
+3.3V: C23.1 C24.1 C25.1 J4.3 P5.1 P5.19 R57.1
DGND: C23.2 C24.2 C25.2 J4.1 P5.2
PB0: J4.2 R57.2
PB8: P5.16
PC6: P5.14
PC7: P5.17
PD11: P5.8
PD15: P5.18
PE0: P5.6
PE1: P5.4
PE2: P5.3
PE3: P5.5
PE4: P5.7
PE5: P5.9
PE6: P5.10
PE7: P5.12

Not connected (* = marked no-connect by the designer): P5 11 13 15 20*

### Library data of the parts
C23-C25 = Cap: 贴片电容; Value: 100pF; Published: 8-Jun-2000; LatestRevisionDate: 17-Jul-2002; LatestRevisionNote: Re-released for DXP Platform.; PackageReference: RAD-0.3; Publisher: Altium Limited
J4 = CON3: Connector
P5 = CON10X2: Header, 10-Pin, Dual row; LatestRevisionDate: 17-Jul-2002; LatestRevisionNote: Re-released for DXP Platform.; Publisher: Altium Limited
R57 = Res: 电阻; Value: 230k; Published: 24-Mar-1999; LatestRevisionDate: 29-May-2009; LatestRevisionNote: IPC-7351 Footprint Added.; PackageVersion: Mar-2003; PackageReference: 6-0805; Publisher: Altium Limited; PackageDescription: Chip Resistor 0805 Case Size; Code_IPC: RESC2012

## Sheet SD_NRF_RC522_W5500.SchDoc
size A4
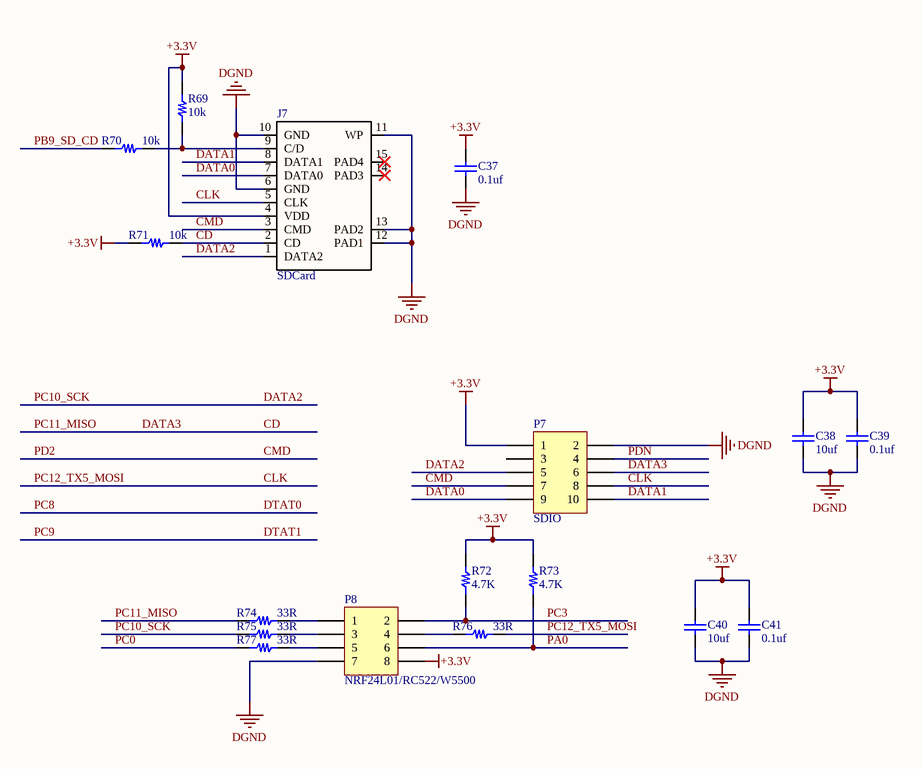
[diagram p9: SD_NRF_RC522_W5500.SchDoc]

### Parts
C37  0.1uf  [0805C]
C38  10uf  [0805C]
C39  0.1uf  [0805C]
C40  10uf  [0805C]
C41  0.1uf  [0805C]
J7  SDCard  [TFP09-2-12B]
P7  SDIO  [HDR2X5-2.54MM]
P8  NRF24L01/RC522/W5500  [HDR2X4-2.54MM]
R69  10k  [0805_small]
R70  10k  [0805_small]
R71  10k  [0805_small]
R72  4.7K  [0805_small]
R73  4.7K  [0805_small]
R74  33R  [0805_small]
R75  33R  [0805_small]
R76  33R  [0805_small]
R77  33R  [0805_small]

### Nets
+3.3V: C37.1 C38.1 C39.1 C40.1 C41.1 J7.4(VDD) P7.1 P8.8 R69.1 R71.1 R72.2 R73.2
DGND: C37.2 C38.2 C39.2 C40.2 C41.2 J7.6(GND) J7.10(GND) J7.11(WP) J7.12(PAD1) J7.13(PAD2) P7.2 P8.7
CD: J7.2(CD) P7.6 R71.2 R74.1  [also labelled DATA3, PC11_MISO]
CLK: J7.5(CLK) P7.8 R76.2  [also labelled PC12_TX5_MOSI]
CMD: J7.3(CMD) P7.7  [also labelled PD2]
DATA0: J7.7(DATA0) P7.9
DATA1: J7.8(DATA1) P7.10
DATA2: J7.1(DATA2) P7.5 R75.1  [also labelled PC10_SCK]
PA0: P8.6 R73.1
PB9_SD_CD: R70.1
PC0: R77.1
PC3: P8.2 R72.1
PDN: P7.4  [project net PA6]
NetJ7_9: J7.9(C/D) R69.2 R70.2
NetP8_1: P8.1 R74.2
NetP8_3: P8.3 R75.2
NetP8_4: P8.4 R76.1
NetP8_5: P8.5 R77.2

Not connected (* = marked no-connect by the designer): J7 14(PAD3)* 15(PAD4)*; P7 3

### Library data of the parts
C37-C41 = Cap: 贴片电容; Value: 100pF; Published: 8-Jun-2000; LatestRevisionDate: 17-Jul-2002; LatestRevisionNote: Re-released for DXP Platform.; PackageReference: RAD-0.3; Publisher: Altium Limited
J7 = sd_card_tf_0: 带弹簧的SD-TF卡座
P7 = CON5X2: Header, 5-Pin, Dual row; LatestRevisionDate: 17-Jul-2002; LatestRevisionNote: Re-released for DXP Platform.; Publisher: Altium Limited
P8 = CON4X2: Header, 4-Pin, Dual row; LatestRevisionDate: 17-Jul-2002; LatestRevisionNote: Re-released for DXP Platform.; Publisher: Altium Limited
R69-R77 = Res: 电阻; Value: 230k; Published: 24-Mar-1999; LatestRevisionDate: 29-May-2009; LatestRevisionNote: IPC-7351 Footprint Added.; PackageVersion: Mar-2003; PackageReference: 6-0805; Publisher: Altium Limited; PackageDescription: Chip Resistor 0805 Case Size; Code_IPC: RESC2012

## Sheet IO.SchDoc
size A4
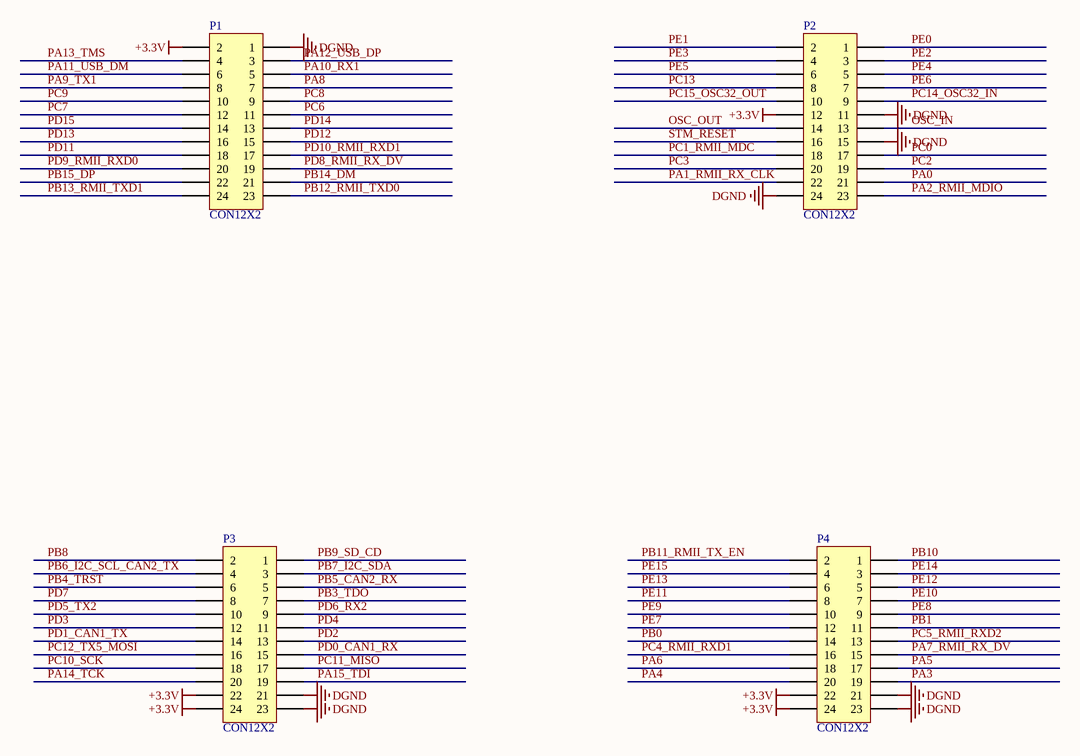
[diagram p10: IO.SchDoc]

### Parts
P1  CON12X2  [HDR2X12-2.54MM]
P2  CON12X2  [HDR2X12-2.54MM]
P3  CON12X2  [HDR2X12-2.54MM]
P4  CON12X2  [HDR2X12-2.54MM]

### Nets
+3.3V: P1.2 P2.12 P3.22 P3.24 P4.22 P4.24
DGND: P1.1 P2.11 P2.15 P2.24 P3.21 P3.23 P4.21 P4.23
OSC_IN: P2.13
OSC_OUT: P2.14
PA0: P2.21
PA1_RMII_RX_CLK: P2.22
PA2_RMII_MDIO: P2.23
PA3: P4.19
PA4: P4.20
PA5: P4.17
PA6: P4.18
PA7_RMII_RX_DV: P4.15
PA8: P1.7
PA9_TX1: P1.8
PA10_RX1: P1.5
PA11_USB_DM: P1.6
PA12_USB_DP: P1.3
PA13_TMS: P1.4
PA14_TCK: P3.20
PA15_TDI: P3.19
PB0: P4.14
PB1: P4.11
PB3_TDO: P3.7
PB4_TRST: P3.6
PB5_CAN2_RX: P3.5
PB6_I2C_SCL_CAN2_TX: P3.4
PB7_I2C_SDA: P3.3
PB8: P3.2
PB9_SD_CD: P3.1
PB10: P4.1
PB11_RMII_TX_EN: P4.2
PB12_RMII_TXD0: P1.23
PB13_RMII_TXD1: P1.24
PB14_DM: P1.21
PB15_DP: P1.22
PC0: P2.17
PC1_RMII_MDC: P2.18
PC2: P2.19
PC3: P2.20
PC4_RMII_RXD1: P4.16
PC5_RMII_RXD2: P4.13
PC6: P1.11
PC7: P1.12
PC8: P1.9  [project net DTAT0]
PC9: P1.10  [project net DTAT1]
PC10_SCK: P3.18  [project net DATA2]
PC11_MISO: P3.17  [project net CD]
PC12_TX5_MOSI: P3.16  [project net CLK]
PC13: P2.8
PC14_OSC32_IN: P2.9
PC15_OSC32_OUT: P2.10
PD0_CAN1_RX: P3.15
PD1_CAN1_TX: P3.14
PD2: P3.13  [project net CMD]
PD3: P3.12
PD4: P3.11
PD5_TX2: P3.10
PD6_RX2: P3.9
PD7: P3.8
PD8_RMII_RX_DV: P1.19
PD9_RMII_RXD0: P1.20
PD10_RMII_RXD1: P1.17
PD11: P1.18
PD12: P1.15
PD13: P1.16
PD14: P1.13
PD15: P1.14
PE0: P2.1
PE1: P2.2
PE2: P2.3
PE3: P2.4
PE4: P2.5
PE5: P2.6
PE6: P2.7
PE7: P4.12
PE8: P4.9
PE9: P4.10
PE10: P4.7
PE11: P4.8
PE12: P4.5
PE13: P4.6
PE14: P4.3
PE15: P4.4
STM_RESET: P2.16

### Library data of the parts
P1-P4 = CON12X2: Header, 12-Pin, Dual row; LatestRevisionDate: 17-Jul-2002; LatestRevisionNote: Re-released for DXP Platform.; Publisher: Altium Limited

## Nets that join several sheets
+3.3V: at24c02_SST25FV080B_OLED (14 pins), power (7 pins), STM32F107_207 (15 pins), led (8 pins), Ethernet (25 pins), CAN (D1.1 D2.1 D3.1 D4.1), RS232_485 (6 pins), OV2640 (7 pins), SD_NRF_RC522_W5500 (12 pins), IO (6 pins)
+5V: power (8 pins), CAN (U3.3 U4.3), RS232_485 (C36.1 R63.1 U8.8), USB (C58.1 C59.1 J9.1 W15.2)
DGND: at24c02_SST25FV080B_OLED (13 pins), power (14 pins), STM32F107_207 (35 pins), led (8 pins), Ethernet (24 pins), CAN (R13.1 R19.1 U3.2 U4.2), RS232_485 (9 pins), USB (10 pins), OV2640 (5 pins), SD_NRF_RC522_W5500 (12 pins), IO (8 pins)
CD: at24c02_SST25FV080B_OLED (R9.2), STM32F107_207 (U9.79), SD_NRF_RC522_W5500 (J7.2 P7.6 R71.2 R74.1), IO (P3.17)
CLK: at24c02_SST25FV080B_OLED (R11.1), STM32F107_207 (U9.80), SD_NRF_RC522_W5500 (J7.5 P7.8 R76.2), IO (P3.16)
CMD: STM32F107_207 (U9.83), SD_NRF_RC522_W5500 (J7.3 P7.7), IO (P3.13)
DATA2: at24c02_SST25FV080B_OLED (R10.1), STM32F107_207 (U9.78), SD_NRF_RC522_W5500 (J7.1 P7.5 R75.1), IO (P3.18)
DTAT0: STM32F107_207 (U9.65), IO (P1.9)
DTAT1: STM32F107_207 (U9.66), IO (P1.10)
OSC_IN: STM32F107_207 (U9.12 W19.2), IO (P2.13)
OSC_OUT: STM32F107_207 (U9.13 W20.2), IO (P2.14)
PA0: STM32F107_207 (U9.23), SD_NRF_RC522_W5500 (P8.6 R73.1), IO (P2.21)
PA1_RMII_RX_CLK: STM32F107_207 (W16.1), Ethernet (U5.34 XTAL1.3), IO (P2.22)
PA2_RMII_MDIO: STM32F107_207 (U9.25), Ethernet (R37.2 U5.30), IO (P2.23)
PA3: STM32F107_207 (U9.26), IO (P4.19)
PA4: STM32F107_207 (U9.29), led (D5.2), IO (P4.20)
PA5: STM32F107_207 (U9.30), led (D6.2), IO (P4.17)
PA6: STM32F107_207 (U9.31), SD_NRF_RC522_W5500 (P7.4), IO (P4.18)
PA7_RMII_RX_DV: STM32F107_207 (U9.32), Ethernet (R38.2 W8.1), IO (P4.15)
PA8: STM32F107_207 (U9.67), IO (P1.7)
PA9_TX1: STM32F107_207 (U9.68), RS232_485 (R61.1 U7.10), IO (P1.8)
PA10_RX1: STM32F107_207 (U9.69), RS232_485 (R62.1 U7.9), USB (R91.2), IO (P1.5)
PA11_USB_DM: STM32F107_207 (U9.70), USB (R89.2), IO (P1.6)
PA12_USB_DP: STM32F107_207 (U9.71), USB (R90.2), IO (P1.3)
PA13_TMS: STM32F107_207 (P9.7 R85.2 U9.72), IO (P1.4)
PA14_TCK: STM32F107_207 (P9.9 R88.1 U9.76), IO (P3.20)
PA15_TDI: STM32F107_207 (P9.5 R84.2 U9.77), IO (P3.19)
PB0: STM32F107_207 (U9.35), OV2640 (J4.2 R57.2), IO (P4.14)
PB1: STM32F107_207 (U9.36), led (D7.2), IO (P4.11)
PB3_TDO: STM32F107_207 (P9.13 R86.2 U9.89), IO (P3.7)
PB4_TRST: STM32F107_207 (P9.3 R83.2 U9.90), IO (P3.6)
PB5_CAN2_RX: STM32F107_207 (U9.91), CAN (R21.1 U4.4), IO (P3.5)
PB6_I2C_SCL_CAN2_TX: at24c02_SST25FV080B_OLED (R2.1 R3.1 R4.2), STM32F107_207 (U9.92), CAN (R18.1 U4.1), IO (P3.4)
PB7_I2C_SDA: at24c02_SST25FV080B_OLED (R1.1 R5.1 R6.2), STM32F107_207 (U9.93), IO (P3.3)
PB8: STM32F107_207 (U9.95), OV2640 (P5.16), IO (P3.2)
PB9_SD_CD: STM32F107_207 (U9.96), SD_NRF_RC522_W5500 (R70.1), IO (P3.1)
PB10: STM32F107_207 (U9.47), IO (P4.1)
PB11_RMII_TX_EN: STM32F107_207 (U9.48), Ethernet (R28.2), IO (P4.2)
PB12_RMII_TXD0: STM32F107_207 (U9.51), Ethernet (R29.2), IO (P1.23)
PB13_RMII_TXD1: STM32F107_207 (U9.52), Ethernet (R30.2), IO (P1.24)
PB14_DM: STM32F107_207 (U9.53), USB (J9.2), IO (P1.21)
PB15_DP: STM32F107_207 (U9.54), USB (J9.3), IO (P1.22)
PC0: STM32F107_207 (U9.15), SD_NRF_RC522_W5500 (R77.1), IO (P2.17)
PC1_RMII_MDC: STM32F107_207 (U9.16), Ethernet (U5.31), IO (P2.18)
PC2: at24c02_SST25FV080B_OLED (R7.1 R8.2), STM32F107_207 (U9.17), IO (P2.19)
PC3: STM32F107_207 (U9.18), SD_NRF_RC522_W5500 (P8.2 R72.1), IO (P2.20)
PC4_RMII_RXD1: STM32F107_207 (U9.33), Ethernet (W5.2), IO (P4.16)
PC5_RMII_RXD2: STM32F107_207 (U9.34), Ethernet (W4.2), IO (P4.13)
PC6: STM32F107_207 (U9.63), OV2640 (P5.14), IO (P1.11)
PC7: STM32F107_207 (U9.64), OV2640 (P5.17), IO (P1.12)
PC13: STM32F107_207 (U9.7), IO (P2.8)
PC14_OSC32_IN: STM32F107_207 (U9.8 W18.2), IO (P2.9)
PC15_OSC32_OUT: STM32F107_207 (U9.9 W17.2), IO (P2.10)
PD0_CAN1_RX: STM32F107_207 (U9.81), CAN (R15.1 U3.4), IO (P3.15)
PD1_CAN1_TX: STM32F107_207 (U9.82), CAN (R12.1 U3.1), IO (P3.14)
PD3: STM32F107_207 (U9.84), IO (P3.12)
PD4: STM32F107_207 (U9.85), IO (P3.11)
PD5_TX2: STM32F107_207 (U9.86), RS232_485 (R66.1 U8.4), IO (P3.10)
PD6_RX2: STM32F107_207 (U9.87), RS232_485 (R64.1 U8.1), IO (P3.9)
PD7: STM32F107_207 (U9.88), RS232_485 (R68.1 U8.2 U8.3), IO (P3.8)
PD8_RMII_RX_DV: STM32F107_207 (U9.55), IO (P1.19)
PD9_RMII_RXD0: STM32F107_207 (U9.56), Ethernet (W6.2), IO (P1.20)
PD10_RMII_RXD1: STM32F107_207 (U9.57), Ethernet (W3.2), IO (P1.17)
PD11: STM32F107_207 (U9.58), OV2640 (P5.8), IO (P1.18)
PD12: STM32F107_207 (U9.59), IO (P1.15)
PD13: STM32F107_207 (U9.60), IO (P1.16)
PD14: STM32F107_207 (U9.61), IO (P1.13)
PD15: STM32F107_207 (U9.62), OV2640 (P5.18), IO (P1.14)
PE0: STM32F107_207 (U9.97), OV2640 (P5.6), IO (P2.1)
PE1: STM32F107_207 (U9.98), OV2640 (P5.4), IO (P2.2)
PE2: STM32F107_207 (U9.1), OV2640 (P5.3), IO (P2.3)
PE3: STM32F107_207 (U9.2), OV2640 (P5.5), IO (P2.4)
PE4: STM32F107_207 (U9.3), OV2640 (P5.7), IO (P2.5)
PE5: STM32F107_207 (U9.4), OV2640 (P5.9), IO (P2.6)
PE6: STM32F107_207 (U9.5), OV2640 (P5.10), IO (P2.7)
PE7: STM32F107_207 (U9.38), OV2640 (P5.12), IO (P4.12)
PE8: STM32F107_207 (U9.39), IO (P4.9)
PE9: STM32F107_207 (U9.40), IO (P4.10)
PE10: STM32F107_207 (U9.41), IO (P4.7)
PE11: STM32F107_207 (U9.42), led (D8.2), IO (P4.8)
PE12: STM32F107_207 (U9.43), led (C19.2 R52.2 S1.1), IO (P4.5)
PE13: STM32F107_207 (U9.44), led (C22.2 R49.2 S4.1), IO (P4.6)
PE14: STM32F107_207 (U9.45), led (C21.2 R50.2 S3.1), IO (P4.3)
PE15: STM32F107_207 (U9.46), led (C20.2 R51.2 S2.1), IO (P4.4)
STM_RESET: STM32F107_207 (5 pins), Ethernet (U5.29), IO (P2.16)